# EAGLE design Regolatori_ua78xx (EAGLE 9.5.0)
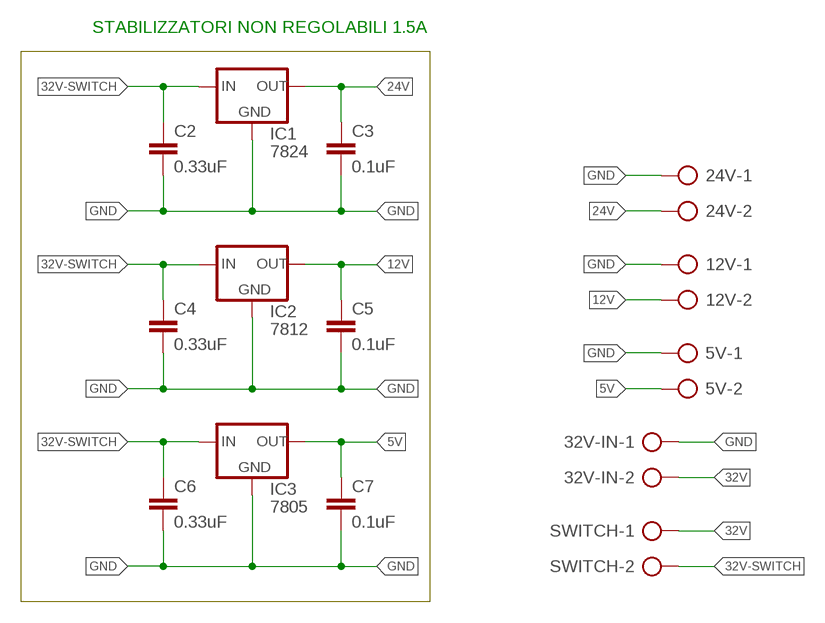
[diagram p0: schematic, sheet 1]

## Parts
5V  SMKDSP_1,5/2  [SMKDSP_1,5/2]
12V  SMKDSP_1,5/2  [SMKDSP_1,5/2]
24V  SMKDSP_1,5/2  [SMKDSP_1,5/2]
32V-IN  SMKDSP_1,5/2  [SMKDSP_1,5/2]
C2  0.33uF  C-EU025-025X050  [C025-025X050]
C3  0.1uF  C-EU025-025X050  [C025-025X050]
C4  0.33uF  C-EU025-025X050  [C025-025X050]
C5  0.1uF  C-EU025-025X050  [C025-025X050]
C6  0.33uF  C-EU025-025X050  [C025-025X050]
C7  0.1uF  C-EU025-025X050  [C025-025X050]
IC1  7824  78XXS  [78XXS]
IC2  7812  78XXS  [78XXS]
IC3  7805  78XXS  [78XXS]
SWITCH  SMKDSP_1,5/2  [SMKDSP_1,5/2]

## Nets
5V: 5V.2 C7.1 IC3.OUT
12V: 12V.2 C5.1 IC2.OUT
24V: 24V.2 C3.1 IC1.OUT
32V: 32V-IN.2 SWITCH.1
32V-SWITCH: C2.1 C4.1 C6.1 IC1.IN IC2.IN IC3.IN SWITCH.2
GND: 5V.1 12V.1 24V.1 32V-IN.1 C2.2 C3.2 C4.2 C5.2 C6.2 C7.2 IC1.GND IC2.GND IC3.GND

## Notes on the sheet
- STABILIZZATORI NON REGOLABILI 1.5A

## Library data of the parts
5V 12V 24V 32V-IN SWITCH = con-phoenix-smkdsp:SMKDSP_1,5/2: Printklemme, Nennstrom: 17,5 A, Bemessungsspannung: 250 V, Raster: 5,0 mm Source: http://eshop.phoenixcontact.de .. 1733415.pdf; MF: FARNELL; MPN: 1733570; OC_FARNELL: 3041244; OC_NEWARK: 69C8588
C2-C7 = rcl:C-EU: CAPACITOR, European symbol; SPICEPREFIX: C
IC1-IC3 = v-reg:78XXS: VOLTAGE REGULATOR

## Net classes
0 default: width 0.178 mm

## Board
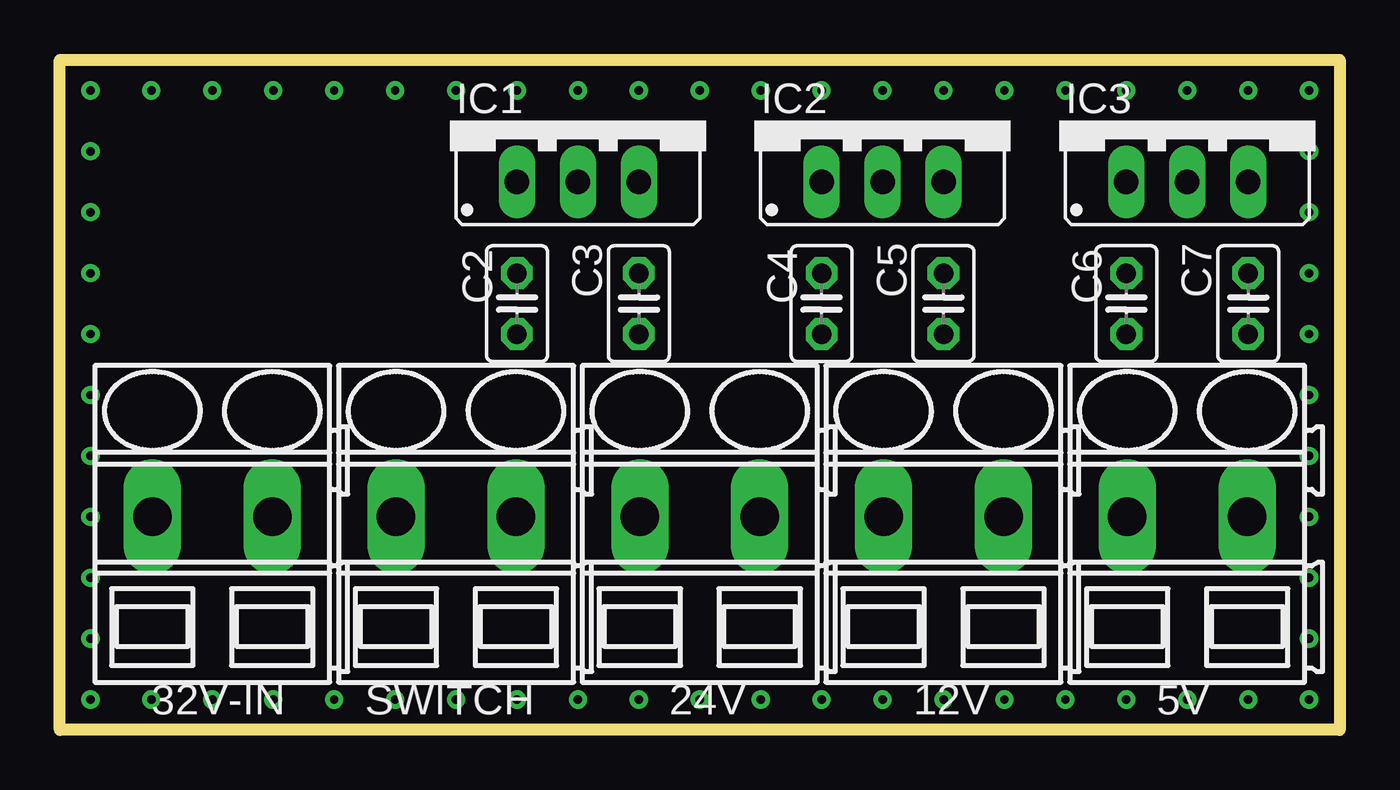
[diagram p1: board, top side]
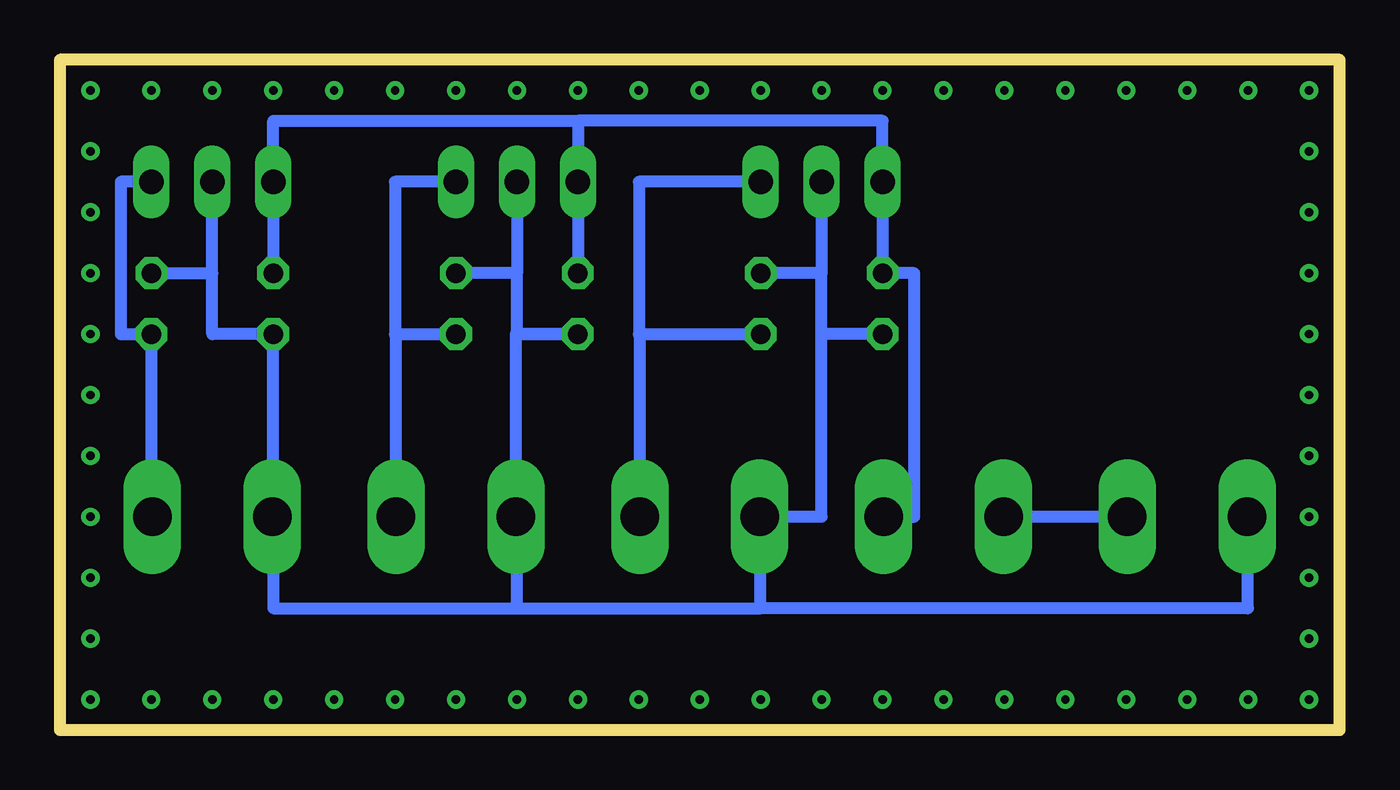
[diagram p2: board, bottom side, seen from below]

Size 53.34 x 27.94 mm. Coordinates in mm from the lower left corner, seen from the top.
Outline: 0,27.94 53.34,27.94 53.34,0 0,0 0,27.94
Copper layers (1*16): Top 0.035mm / dielectric 1.5mm / Bottom 0.035mm
Design rules "default": minimum track width 6mil, minimum drill 0.35mm, track to track 6mil, track to pad 6mil, pad to pad 6mil, via to via 6mil, smd to smd 6mil, copper to edge 40mil, drill to drill 6mil, minimum pad ring 10mil, minimum via ring 8mil, stop-mask expansion 4mil, vias tented up to drill 0mil, thermal gap 10mil

### Footprints (pad centres in the part's own frame; a part is rotated, then mirrored left to right if it is on the bottom)
SMKDSP_1,5/2 = drill 1.6 pad 1.8 long: 1 -2.5,0; 2 2.5,0
C025-025X050 = drill 0.813 octagon: 1 -1.27,0; 2 1.27,0
78XXS = drill 1.016 long: GND 0,-2.54; IN -2.54,-2.54; OUT 2.54,-2.54

### Placement (x,y rotation side)
5V  46.99,8.89 0 top
12V  36.83,8.89 0 top
24V  26.67,8.89 0 top
32V-IN  6.35,8.89 0 top
C2  19.05,17.78 270 top
C3  24.13,17.78 90 top
C4  31.75,17.78 270 top
C5  36.83,17.78 90 top
C6  44.45,17.78 270 top
C7  49.53,17.78 90 top
IC1  21.59,25.4 0 top
IC2  34.29,25.4 0 top
IC3  46.99,25.4 0 top
SWITCH  16.51,8.89 0 top

### Tracks (layer width: path | path; a pad name or v marks a point on that pad's centre or on a via)
5V
  Bottom 0.508: IC3.OUT 50.8,22.86 50.8,16.51 C7.1 49.53,8.89 5V.2
12V
  Bottom 0.508: 12V.2 39.33,16.51 C5.1 39.37,16.51 39.37,22.86 IC2.OUT
24V
  Bottom 0.508: 24V.2 29.17,16.51 C3.1 29.21,16.51 29.21,22.86 IC1.OUT
32V
  Bottom 0.508: 32V-IN.2 SWITCH.1
32V-SWITCH
  Bottom 0.508: 31.75,25.4 19.05,25.4 IC1.IN C2.1 17.74,19.05 17.74,8.89 SWITCH.2 | 31.75,25.4 IC2.IN C4.1 | 31.75,25.4 44.45,25.4 IC3.IN C6.1
GND
  Bottom 0.508: 21.59,16.51 21.59,8.89 24.13,8.89 | 21.59,16.51 21.59,19.05 | 21.59,19.05 C3.2 | 34.29,19.05 34.29,16.51 C4.2 34.33,16.51 12V.1 34.29,8.89 34.29,5.08 | 46.99,19.05 46.99,16.51 C6.2 44.45,8.89 | C7.2 46.99,19.05 | 46.99,19.05 IC3.GND | IC2.GND 34.29,19.05 | 34.29,19.05 C5.2 | IC1.GND 21.59,19.05 | 5V.1 44.45,8.89 | 44.45,8.89 44.45,5.08 34.29,5.08 | 34.29,5.08 24.13,5.08 | 24.13,5.08 24.13,8.89 | C2.2 21.59,16.51 | 24.13,8.89 24V.1 | 32V-IN.1 3.85,5.08 | 3.85,5.08 3.81,5.08 | 3.85,5.08 24.13,5.08
N$1  (via drill 0.35)
  other vias: 1.27,8.89
N$2  (via drill 0.35)
  other vias: 1.27,11.43
N$3  (via drill 0.35)
  other vias: 1.27,13.97
N$4  (via drill 0.35)
  other vias: 1.27,16.51
N$5  (via drill 0.35)
  other vias: 1.27,19.05
N$6  (via drill 0.35)
  other vias: 1.27,21.59
N$7  (via drill 0.35)
  other vias: 1.27,24.13
N$8  (via drill 0.35)
  other vias: 1.27,26.67
N$9  (via drill 0.35)
  other vias: 3.81,26.67
N$10  (via drill 0.35)
  other vias: 6.35,26.67
N$11  (via drill 0.35)
  other vias: 8.89,26.67
N$12  (via drill 0.35)
  other vias: 11.43,26.67
N$13  (via drill 0.35)
  other vias: 13.97,26.67
N$14  (via drill 0.35)
  other vias: 16.51,26.67
N$15  (via drill 0.35)
  other vias: 19.05,26.67
N$16  (via drill 0.35)
  other vias: 21.59,26.67
N$17  (via drill 0.35)
  other vias: 24.13,26.67
N$18  (via drill 0.35)
  other vias: 26.67,26.67
N$19  (via drill 0.35)
  other vias: 29.21,26.67
N$20  (via drill 0.35)
  other vias: 31.75,26.67
N$21  (via drill 0.35)
  other vias: 34.29,26.67
N$22  (via drill 0.35)
  other vias: 36.83,26.67
N$23  (via drill 0.35)
  other vias: 39.37,26.67
N$24  (via drill 0.35)
  other vias: 41.91,26.67
N$25  (via drill 0.35)
  other vias: 44.45,26.67
N$26  (via drill 0.35)
  other vias: 46.99,26.67
N$27  (via drill 0.35)
  other vias: 49.53,26.67
N$28  (via drill 0.35)
  other vias: 52.07,26.67
N$29  (via drill 0.35)
  other vias: 52.07,24.13
N$30  (via drill 0.35)
  other vias: 52.07,21.59
N$31  (via drill 0.35)
  other vias: 52.07,19.05
N$32  (via drill 0.35)
  other vias: 52.07,16.51
N$33  (via drill 0.35)
  other vias: 52.07,13.97
N$34  (via drill 0.35)
  other vias: 52.07,11.43
N$35  (via drill 0.35)
  other vias: 52.07,8.89
N$36  (via drill 0.35)
  other vias: 52.07,6.35
N$37  (via drill 0.35)
  other vias: 52.07,3.81
N$38  (via drill 0.35)
  other vias: 52.07,1.27
N$39  (via drill 0.35)
  other vias: 49.53,1.27
N$40  (via drill 0.35)
  other vias: 46.99,1.27
N$41  (via drill 0.35)
  other vias: 44.45,1.27
N$42  (via drill 0.35)
  other vias: 41.91,1.27
N$43  (via drill 0.35)
  other vias: 39.37,1.27
N$44  (via drill 0.35)
  other vias: 36.83,1.27
N$45  (via drill 0.35)
  other vias: 34.29,1.27
N$46  (via drill 0.35)
  other vias: 31.75,1.27
N$47  (via drill 0.35)
  other vias: 29.21,1.27
N$48  (via drill 0.35)
  other vias: 26.67,1.27
N$49  (via drill 0.35)
  other vias: 24.13,1.27
N$50  (via drill 0.35)
  other vias: 21.59,1.27
N$51  (via drill 0.35)
  other vias: 19.05,1.27
N$52  (via drill 0.35)
  other vias: 16.51,1.27
N$53  (via drill 0.35)
  other vias: 13.97,1.27
N$54  (via drill 0.35)
  other vias: 11.43,1.27
N$55  (via drill 0.35)
  other vias: 8.89,1.27
N$56  (via drill 0.35)
  other vias: 6.35,1.27
N$57  (via drill 0.35)
  other vias: 3.81,1.27
N$58  (via drill 0.35)
  other vias: 1.27,1.27
N$59  (via drill 0.35)
  other vias: 1.27,3.81
N$60  (via drill 0.35)
  other vias: 1.27,6.35